# EAGLE schematic TeensyAmp_R5.0 (EAGLE 9.6.2)

## Sheet 1 of 3
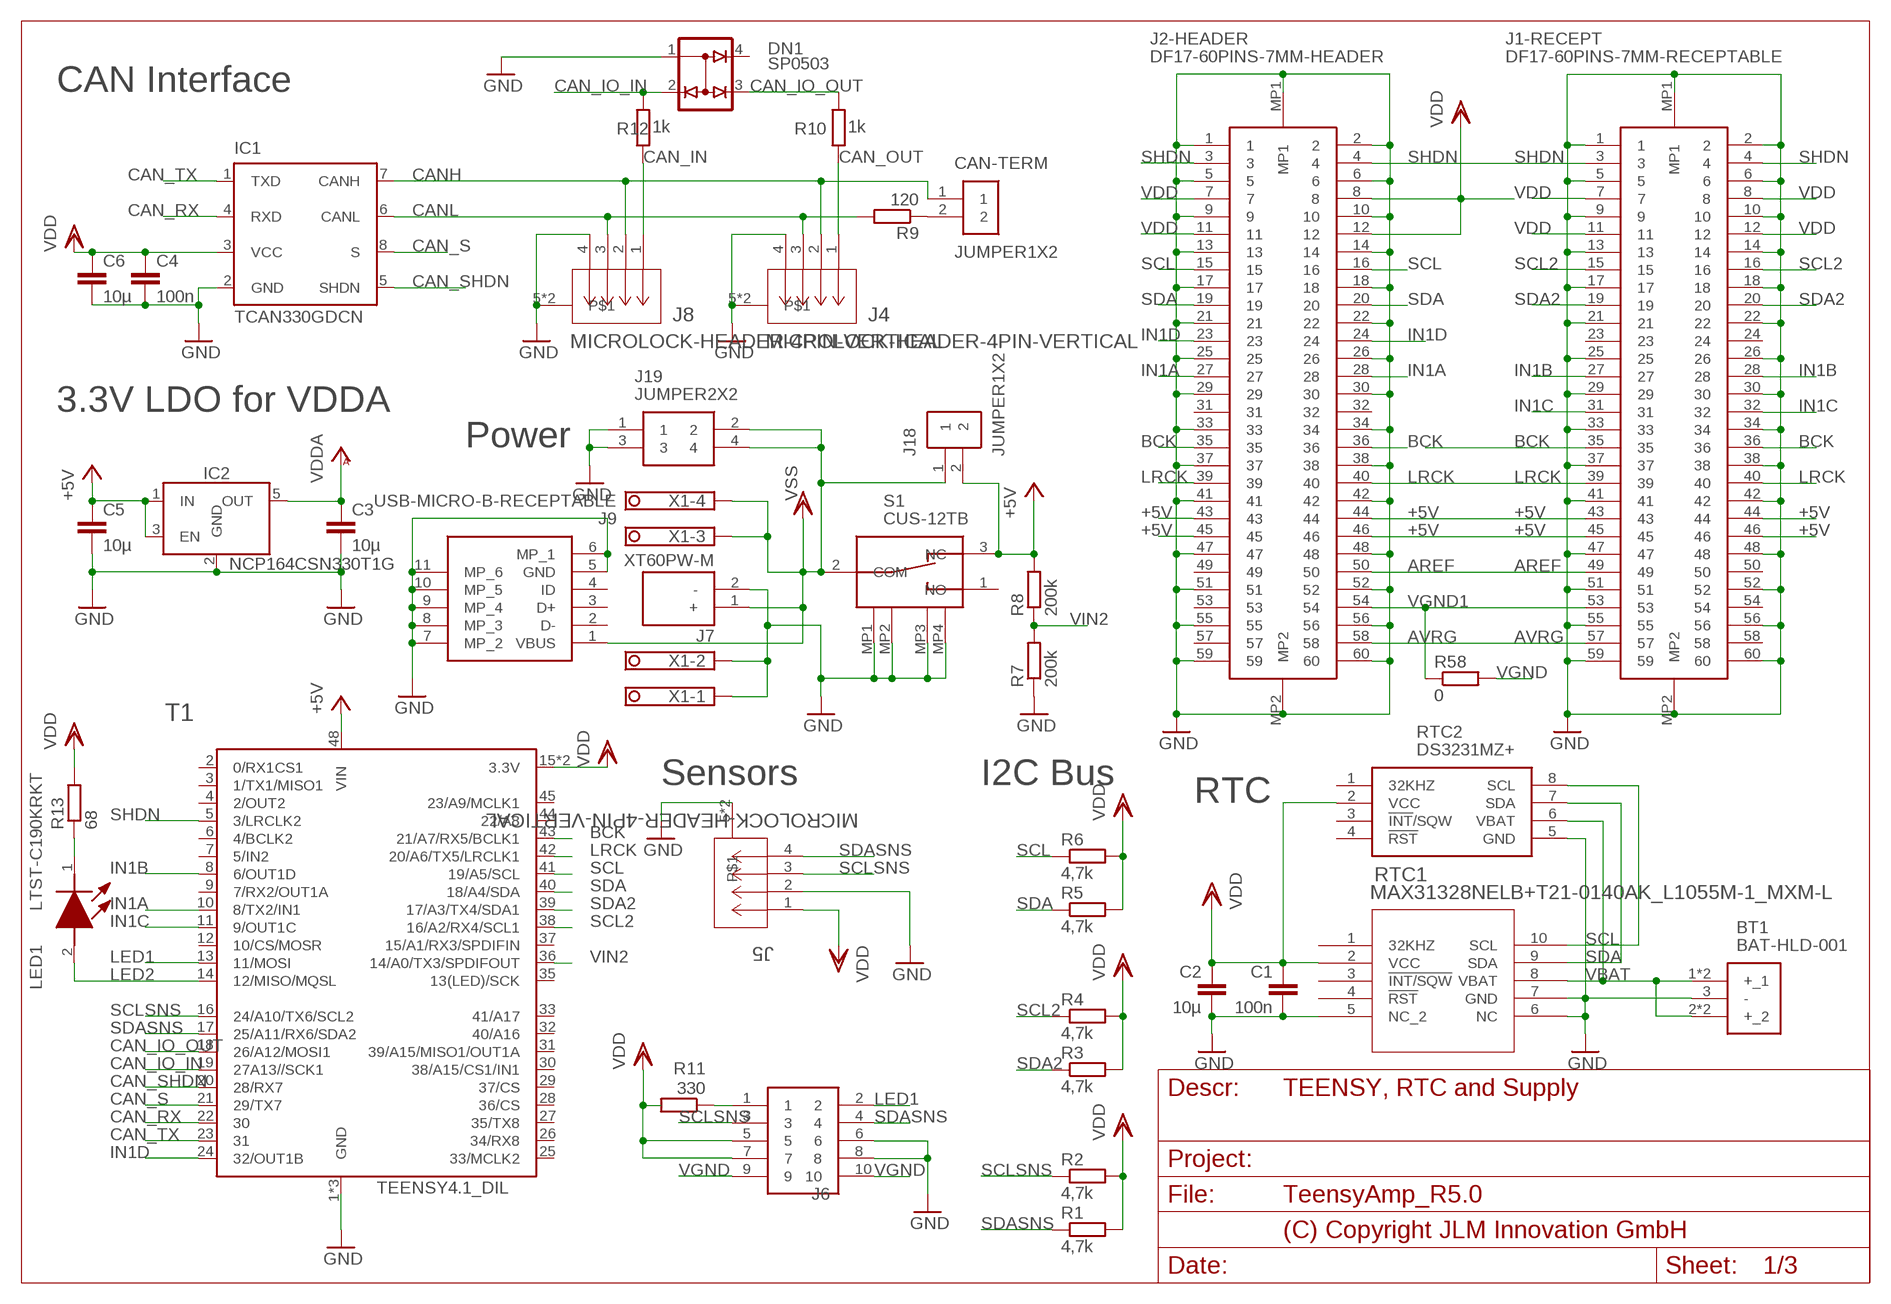
[diagram p0: schematic, sheet 1]
FRAME1 (DINA4_L): PAGE_DESCRIPTION: TEENSY, RTC and Supply

### Parts
BT1  BAT-HLD-001  [BATHLD001]
C1  100n  C-EUC0603  [C0603]
C2  10µ  C-EUC0603  [C0603]
C3  10µ  C-EUC0603  [C0603]
C4  100n  C-EUC0603  [C0603]
C5  10µ  C-EUC0603  [C0603]
C6  10µ  C-EUC0603  [C0603]
CAN-TERM  JUMPER1X2  [JMP1X2]
DN1  SP0503  [SOT143-R]
IC1  TCAN330GDCN  TCAN330DCN  [SOT65P280X145-8N]
IC2  NCP164CSN330T1G  LDO_ENSOT23-5  [SOT23-5]
J1-RECEPT  DF17-60PINS-7MM-RECEPTABLE  [DF173060DS05V57]
J2-HEADER  DF17-60PINS-7MM-HEADER  [DF174060DP05V57]
J4  MICROLOCK-HEADER-4PIN-VERTICAL  [CONN_50556804XX_MOL]
J5  MICROLOCK-HEADER-4PIN-VERTICAL  [CONN_50556804XX_MOL]
J6  JUMPER2x5  JUMPER2X5  [JUMPER2X5FP]
J7  XT60PW-M  [AMASS_XT60PW-M]
J8  MICROLOCK-HEADER-4PIN-VERTICAL  [CONN_50556804XX_MOL]
J9  USB-MICRO-B-RECEPTABLE  [473460001]
J18  JUMPER1X2  [JMP1X2]
J19  JUMPER2X2  [JMP2X2]
LED1  LTST-C190KRKT  LTST-C190KFKT  [LEDC1607X80N]
R1  4,7k  R_JLMR0603  [R0603]
R2  4,7k  R_JLMR0603  [R0603]
R3  4,7k  R_JLMR0603  [R0603]
R4  4,7k  R_JLMR0603  [R0603]
R5  4,7k  R_JLMR0603  [R0603]
R6  4,7k  R_JLMR0603  [R0603]
R7  200k  R_JLMR0603  [R0603]
R8  200k  R_JLMR0603  [R0603]
R9  120  R_JLMR0603  [R0603]
R10  1k  R_JLMR0603  [R0603]
R11  330  R_JLMR0603  [R0603]
R12  1k  R_JLMR0603  [R0603]
R13  68  R_JLMR0603  [R0603]
R58  0  R_JLMR0603  [R0603]
RTC1  MAX31328NELB+T21-0140AK_L1055M-1_MXM-L  [21-0140AK_L1055M-1_MXM-L]
RTC2  DS3231MZ+  [SOIC127P600X175-8N]
S1  CUS-12TB  [CUS12TB]
T1  TEENSY4.1_DIL  [TEENSY4.1_DIL]
X1  TERMINAL-BLOCK-4  [1751264]

### Nets
+5V: C5.1 IC2.1(IN) IC2.3(EN) J1-RECEPT.43 J1-RECEPT.44 J1-RECEPT.45 J1-RECEPT.46 J2-HEADER.43 J2-HEADER.44 J2-HEADER.45 J2-HEADER.46 J18.2 R8.2 S1.3(NC) T1.48(VIN)
AREF: J1-RECEPT.49 J2-HEADER.50 ; also sheet 2,3
AVRG: J1-RECEPT.57 J2-HEADER.58 ; also sheet 2,3
BCK: J1-RECEPT.35 J1-RECEPT.36 J2-HEADER.35 J2-HEADER.36 T1.43(21/A7/RX5/BCLK1) ; also sheet 2,3
CAN_IN: J8.1 R12.2
CAN_IO_IN: DN1.2(C2) R12.1 T1.19(27A13//SCK1)
CAN_IO_OUT: DN1.3(C3) R10.1 T1.18(26/A12/MOSI1)
CAN_OUT: J4.1 R10.2
CAN_RX: IC1.4(RXD) T1.22
CAN_S: IC1.8(S) T1.21(29/TX7)
CAN_SHDN: IC1.5(SHDN) T1.20(28/RX7)
CAN_TX: IC1.1(TXD) T1.23
CANH: CAN-TERM.1 IC1.7(CANH) J4.2 J8.2
CANL: IC1.6(CANL) J4.3 J8.3 R9.2
GND: BT1.3(-) C1.2 C2.2 C3.2 C4.2 C5.2 C6.2 DN1.1(A1) IC1.2(GND) IC2.2(GND) J1-RECEPT.1 J1-RECEPT.2 J1-RECEPT.5 J1-RECEPT.6 J1-RECEPT.9 J1-RECEPT.10 J1-RECEPT.13 J1-RECEPT.14 J1-RECEPT.17 J1-RECEPT.18 J1-RECEPT.21 J1-RECEPT.22 J1-RECEPT.25 J1-RECEPT.26 J1-RECEPT.29 J1-RECEPT.30 J1-RECEPT.33 J1-RECEPT.34 J1-RECEPT.37 J1-RECEPT.38 J1-RECEPT.41 J1-RECEPT.42 J1-RECEPT.47 J1-RECEPT.48 J1-RECEPT.51 J1-RECEPT.52 J1-RECEPT.55 J1-RECEPT.56 J1-RECEPT.59 J1-RECEPT.60 J1-RECEPT.MP1 J1-RECEPT.MP2 J2-HEADER.1 J2-HEADER.2 J2-HEADER.5 J2-HEADER.6 J2-HEADER.9 J2-HEADER.10 J2-HEADER.13 J2-HEADER.14 J2-HEADER.17 J2-HEADER.18 J2-HEADER.21 J2-HEADER.22 J2-HEADER.25 J2-HEADER.26 J2-HEADER.29 J2-HEADER.30 J2-HEADER.33 J2-HEADER.34 J2-HEADER.37 J2-HEADER.38 J2-HEADER.41 J2-HEADER.42 J2-HEADER.47 J2-HEADER.48 J2-HEADER.51 J2-HEADER.52 J2-HEADER.55 J2-HEADER.56 J2-HEADER.59 J2-HEADER.60 J2-HEADER.MP1 J2-HEADER.MP2 J4.4 J4.5 J4.6 J5.2 J5.5 J5.6 J6.6 J6.8 J7.2(-) J8.4 J8.5 J8.6 J9.5(GND) J9.6(MP_1) J9.7(MP_2) J9.8(MP_3) J9.9(MP_4) J9.10(MP_5) J9.11(MP_6) J19.1 J19.3 R7.1 RTC1.5(NC_2) RTC1.6(NC) RTC1.7(GND) RTC2.5(GND) S1.MP1 S1.MP2 S1.MP3 S1.MP4 T1.1(GND) T1.34(GND) T1.47(GND) X1.1 X1.2 ; also sheet 2,3
IN1A: J2-HEADER.27 J2-HEADER.28 T1.10(8/TX2/IN1) ; also sheet 2,3
IN1B: J1-RECEPT.27 J1-RECEPT.28 T1.8(6/OUT1D)
IN1C: J1-RECEPT.31 J1-RECEPT.32 T1.11(9/OUT1C)
IN1D: J2-HEADER.23 J2-HEADER.24 T1.24(32/OUT1B)
LED1: J6.2 T1.13(11/MOSI)
LED2: LED1.2(A) T1.14(12/MISO/MQSL)
LRCK: J1-RECEPT.39 J1-RECEPT.40 J2-HEADER.39 J2-HEADER.40 T1.42(20/A6/TX5/LRCLK1) ; also sheet 2,3
N$1: J6.1 R11.1
N$2: CAN-TERM.2 R9.1
N$4: LED1.1(K) R13.1
SCL: J2-HEADER.15 J2-HEADER.16 R6.1 RTC1.10(SCL) RTC2.8(SCL) T1.41(19/A5/SCL) ; also sheet 2,3
SCL2: J1-RECEPT.15 J1-RECEPT.16 R4.1 T1.38(16/A2/RX4/SCL1)
SCLSNS: J5.3 J6.3 R2.1 T1.16(24/A10/TX6/SCL2)
SDA: J2-HEADER.19 J2-HEADER.20 R5.1 RTC1.9(SDA) RTC2.7(SDA) T1.40(18/A4/SDA) ; also sheet 2,3
SDA2: J1-RECEPT.19 J1-RECEPT.20 R3.1 T1.39(17/A3/TX4/SDA1)
SDASNS: J5.4 J6.4 R1.1 T1.17(25/A11/RX6/SDA2)
SHDN: J1-RECEPT.3 J1-RECEPT.4 J2-HEADER.3 J2-HEADER.4 T1.5(3/LRCLK2) ; also sheet 2,3
VBAT: BT1.1(+_1) BT1.1B(+_1) BT1.2(+_2) BT1.2B(+_2) RTC1.8(VBAT) RTC2.6(VBAT)
VDD: C1.1 C2.1 C4.1 C6.1 IC1.3(VCC) J1-RECEPT.7 J1-RECEPT.8 J1-RECEPT.11 J1-RECEPT.12 J2-HEADER.7 J2-HEADER.8 J2-HEADER.11 J2-HEADER.12 J5.1 J6.5 J6.7 R1.2 R2.2 R3.2 R4.2 R5.2 R6.2 R11.2 R13.2 RTC1.2(VCC) RTC2.2(VCC) T1.15(3.3V) T1.46(3.3V) ; also sheet 2,3
VDDA: C3.1 IC2.5(OUT) ; also sheet 2,3
VGND: J6.9 J6.10 R58.2 ; also sheet 2,3
VGND1: J1-RECEPT.53 J2-HEADER.54 R58.1
VIN2: R7.2 R8.1 T1.36(14/A0/TX3/SPDIFOUT)
VSS: J7.1(+) J9.1(VBUS) J18.1 J19.2 J19.4 S1.2(COM) X1.3 X1.4
Unconnected: DN1.4(C4) J1-RECEPT.23 J1-RECEPT.24 J1-RECEPT.50 J1-RECEPT.54 J1-RECEPT.58 J2-HEADER.31 J2-HEADER.32 J2-HEADER.49 J2-HEADER.53 J2-HEADER.57 J9.2(D-) J9.3(D+) J9.4(ID) RTC1.1(32KHZ) RTC1.3(!INT/SQW) RTC1.4(!RST) RTC2.1(32KHZ) RTC2.3(!INT!/SQW) RTC2.4(!RST) S1.1(NO) T1.2(0/RX1CS1) T1.3(1/TX1/MISO1) T1.4(2/OUT2) T1.6(4/BCLK2) T1.7(5/IN2) T1.9(7/RX2/OUT1A) T1.12(10/CS/MOSR) T1.25(33/MCLK2) T1.26(34/RX8) T1.27(35/TX8) T1.28(36/CS) T1.29(37/CS) T1.30(38/A15/CS1/IN1) T1.31(39/A15/MISO1/OUT1A) T1.32(40/A16) T1.33(41/A17) T1.35(13(LED)/SCK) T1.37(15/A1/RX3/SPDIFIN) T1.44(22/A8) T1.45(23/A9/MCLK1)

### Notes on the sheet
- CAN Interface
- 3.3V LDO for VDDA
- Power
- Sensors | I2C Bus
- RTC

## Sheet 2 of 3
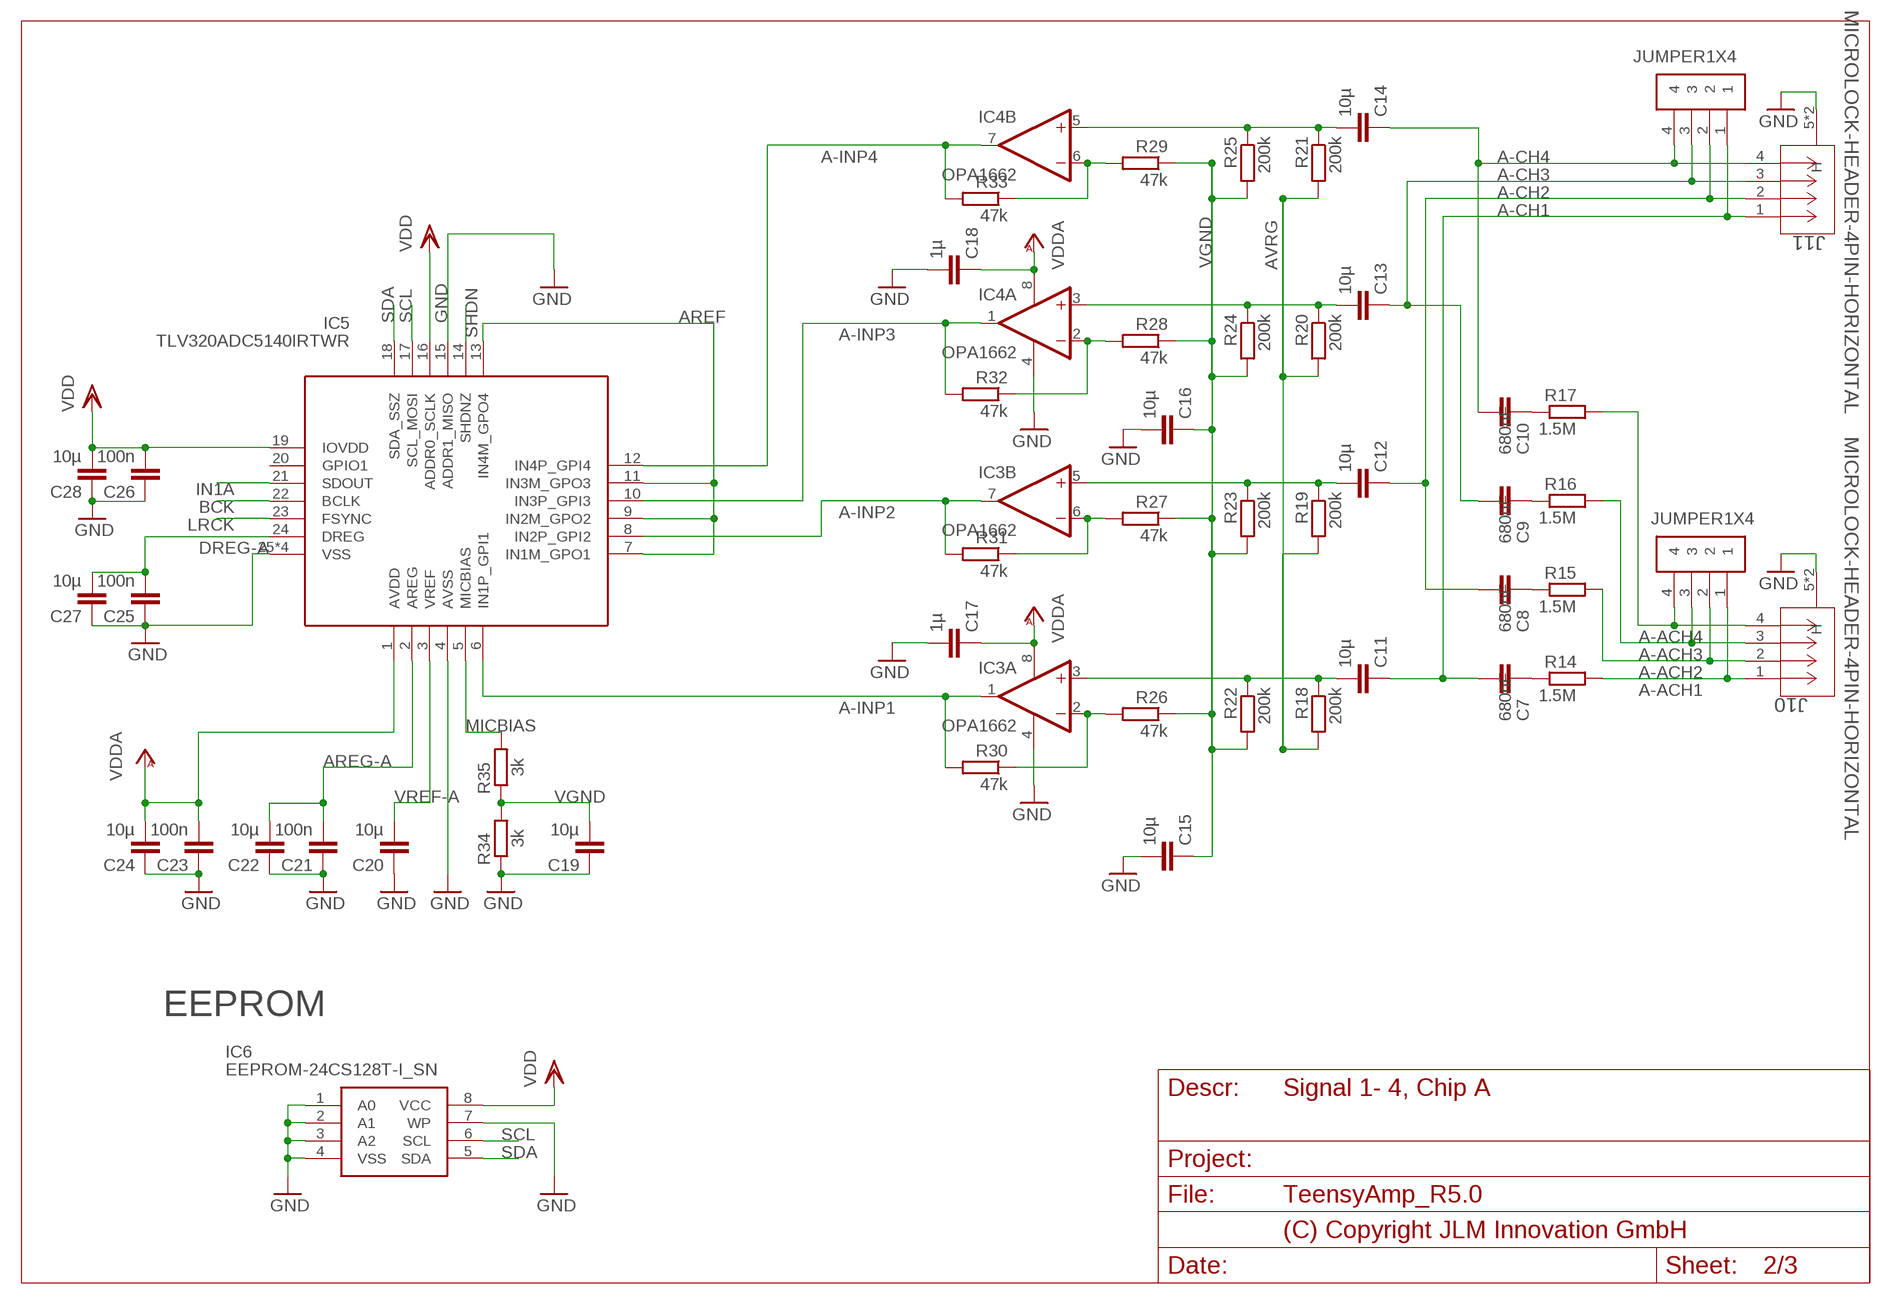
[diagram p1: schematic, sheet 2]
FRAME2 (DINA4_L): PAGE_DESCRIPTION: Signal 1- 4, Chip A

### Parts
C7  680nF  C-EUC0805  [C0805]
C8  680nF  C-EUC0805  [C0805]
C9  680nF  C-EUC0805  [C0805]
C10  680nF  C-EUC0805  [C0805]
C11  10µ  C-EUC0805  [C0805]
C12  10µ  C-EUC0805  [C0805]
C13  10µ  C-EUC0805  [C0805]
C14  10µ  C-EUC0805  [C0805]
C15  10µ  C-EUC0603  [C0603]
C16  10µ  C-EUC0603  [C0603]
C17  1µ  C-EUC0603  [C0603]
C18  1µ  C-EUC0603  [C0603]
C19  10µ  C-EUC0603  [C0603]
C20  10µ  C-EUC0603  [C0603]
C21  100n  C-EUC0603  [C0603]
C22  10µ  C-EUC0603  [C0603]
C23  100n  C-EUC0603  [C0603]
C24  10µ  C-EUC0603  [C0603]
C25  100n  C-EUC0603  [C0603]
C26  100n  C-EUC0603  [C0603]
C27  10µ  C-EUC0603  [C0603]
C28  10µ  C-EUC0603  [C0603]
IC3  OPA1662  OPA2344E  [MSOP08]
IC4  OPA1662  OPA2344E  [MSOP08]
IC5  TLV320ADC5140IRTWR  [QFN50P400X400X80-25N]
IC6  EEPROM-24CS128T-I_SN  [SOIC127P600X175-8N]
J10  MICROLOCK-HEADER-4PIN-HORIZONTAL  [CONN04_5055670471_MOL]
J11  MICROLOCK-HEADER-4PIN-HORIZONTAL  [CONN04_5055670471_MOL]
J12  JUMPER1X4  [JMP1X4]
J13  JUMPER1X4  [JMP1X4]
R14  1.5M  R_JLMR0603  [R0603]
R15  1.5M  R_JLMR0603  [R0603]
R16  1.5M  R_JLMR0603  [R0603]
R17  1.5M  R_JLMR0603  [R0603]
R18  200k  R_JLMR0603  [R0603]
R19  200k  R_JLMR0603  [R0603]
R20  200k  R_JLMR0603  [R0603]
R21  200k  R_JLMR0603  [R0603]
R22  200k  R_JLMR0603  [R0603]
R23  200k  R_JLMR0603  [R0603]
R24  200k  R_JLMR0603  [R0603]
R25  200k  R_JLMR0603  [R0603]
R26  47k  R_JLMR0603  [R0603]
R27  47k  R_JLMR0603  [R0603]
R28  47k  R_JLMR0603  [R0603]
R29  47k  R_JLMR0603  [R0603]
R30  47k  R_JLMR0603  [R0603]
R31  47k  R_JLMR0603  [R0603]
R32  47k  R_JLMR0603  [R0603]
R33  47k  R_JLMR0603  [R0603]
R34  3k  R_JLMR0603  [R0603]
R35  3k  R_JLMR0603  [R0603]

### Nets
A-ACH1: J10.1 J12.1 R14.1
A-ACH2: J10.2 J12.2 R15.1
A-ACH3: J10.3 J12.3 R16.1
A-ACH4: J10.4 J12.4 R17.1
A-CH1: C7.2 C11.1 J11.1 J13.1
A-CH2: C8.2 C12.1 J11.2 J13.2
A-CH3: C9.2 C13.1 J11.3 J13.3
A-CH4: C10.2 C14.1 J11.4 J13.4
A-INP1: IC3.1(A:OUT) IC5.6(IN1P_GPI1) R30.2
A-INP2: IC3.7(B:OUT) IC5.8(IN2P_GPI2) R31.2
A-INP3: IC4.1(A:OUT) IC5.10(IN3P_GPI3) R32.2
A-INP4: IC4.7(B:OUT) IC5.12(IN4P_GPI4) R33.2
AREF: IC5.7(IN1M_GPO1) IC5.9(IN2M_GPO2) IC5.11(IN3M_GPO3) IC5.13(IN4M_GPO4) ; also sheet 1,3
AREG-A: C21.2 C22.2 IC5.2(AREG)
AVRG: R18.2 R19.2 R20.2 R21.2 ; also sheet 1,3
BCK: IC5.22(BCLK) ; also sheet 1,3
DREG-A: C25.2 C27.2 IC5.24(DREG)
GND: C15.2 C16.2 C17.2 C18.2 C19.1 C20.1 C21.1 C22.1 C23.1 C24.1 C25.1 C26.1 C27.1 C28.1 IC3.4(A:V-) IC4.4(A:V-) IC5.4(AVSS) IC5.15(ADDR1_MISO) IC5.25(VSS) IC5.26(VSS) IC5.27(VSS) IC5.28(VSS) IC6.1(A0) IC6.2(A1) IC6.3(A2) IC6.4(VSS) IC6.7(WP) J10.5(H) J10.6(H) J11.5(H) J11.6(H) R34.1 ; also sheet 1,3
IN1A: IC5.21(SDOUT) ; also sheet 1,3
LRCK: IC5.23(FSYNC) ; also sheet 1,3
MICBIAS: IC5.5(MICBIAS) R35.2
N$6: C13.2 IC4.3(A:+IN) R20.1 R24.1
N$8: C14.2 IC4.5(B:+IN) R21.1 R25.1
N$9: C11.2 IC3.3(A:+IN) R18.1 R22.1
N$10: C12.2 IC3.5(B:+IN) R19.1 R23.1
N$13: IC3.6(B:-IN) R27.2 R31.1
N$15: C7.1 R14.2
N$16: C8.1 R15.2
N$18: C9.1 R16.2
N$27: C10.1 R17.2
N$31: IC4.2(A:-IN) R28.2 R32.1
N$32: IC4.6(B:-IN) R29.2 R33.1
N$33: IC3.2(A:-IN) R26.2 R30.1
SCL: IC5.17(SCL_MOSI) IC6.6(SCL) ; also sheet 1,3
SDA: IC5.18(SDA_SSZ) IC6.5(SDA) ; also sheet 1,3
SHDN: IC5.14(SHDNZ) ; also sheet 1,3
VDD: C26.2 C28.2 IC5.16(ADDR0_SCLK) IC5.19(IOVDD) IC6.8(VCC) ; also sheet 1,3
VDDA: C17.1 C18.1 C23.2 C24.2 IC3.8(A:V+) IC4.8(A:V+) IC5.1(AVDD) ; also sheet 1,3
VGND: C15.1 C16.1 C19.2 R22.2 R23.2 R24.2 R25.2 R26.1 R27.1 R28.1 R29.1 R34.2 R35.1 ; also sheet 1,3
VREF-A: C20.2 IC5.3(VREF)
Unconnected: IC5.20(GPIO1)

### Notes on the sheet
- EEPROM

## Sheet 3 of 3
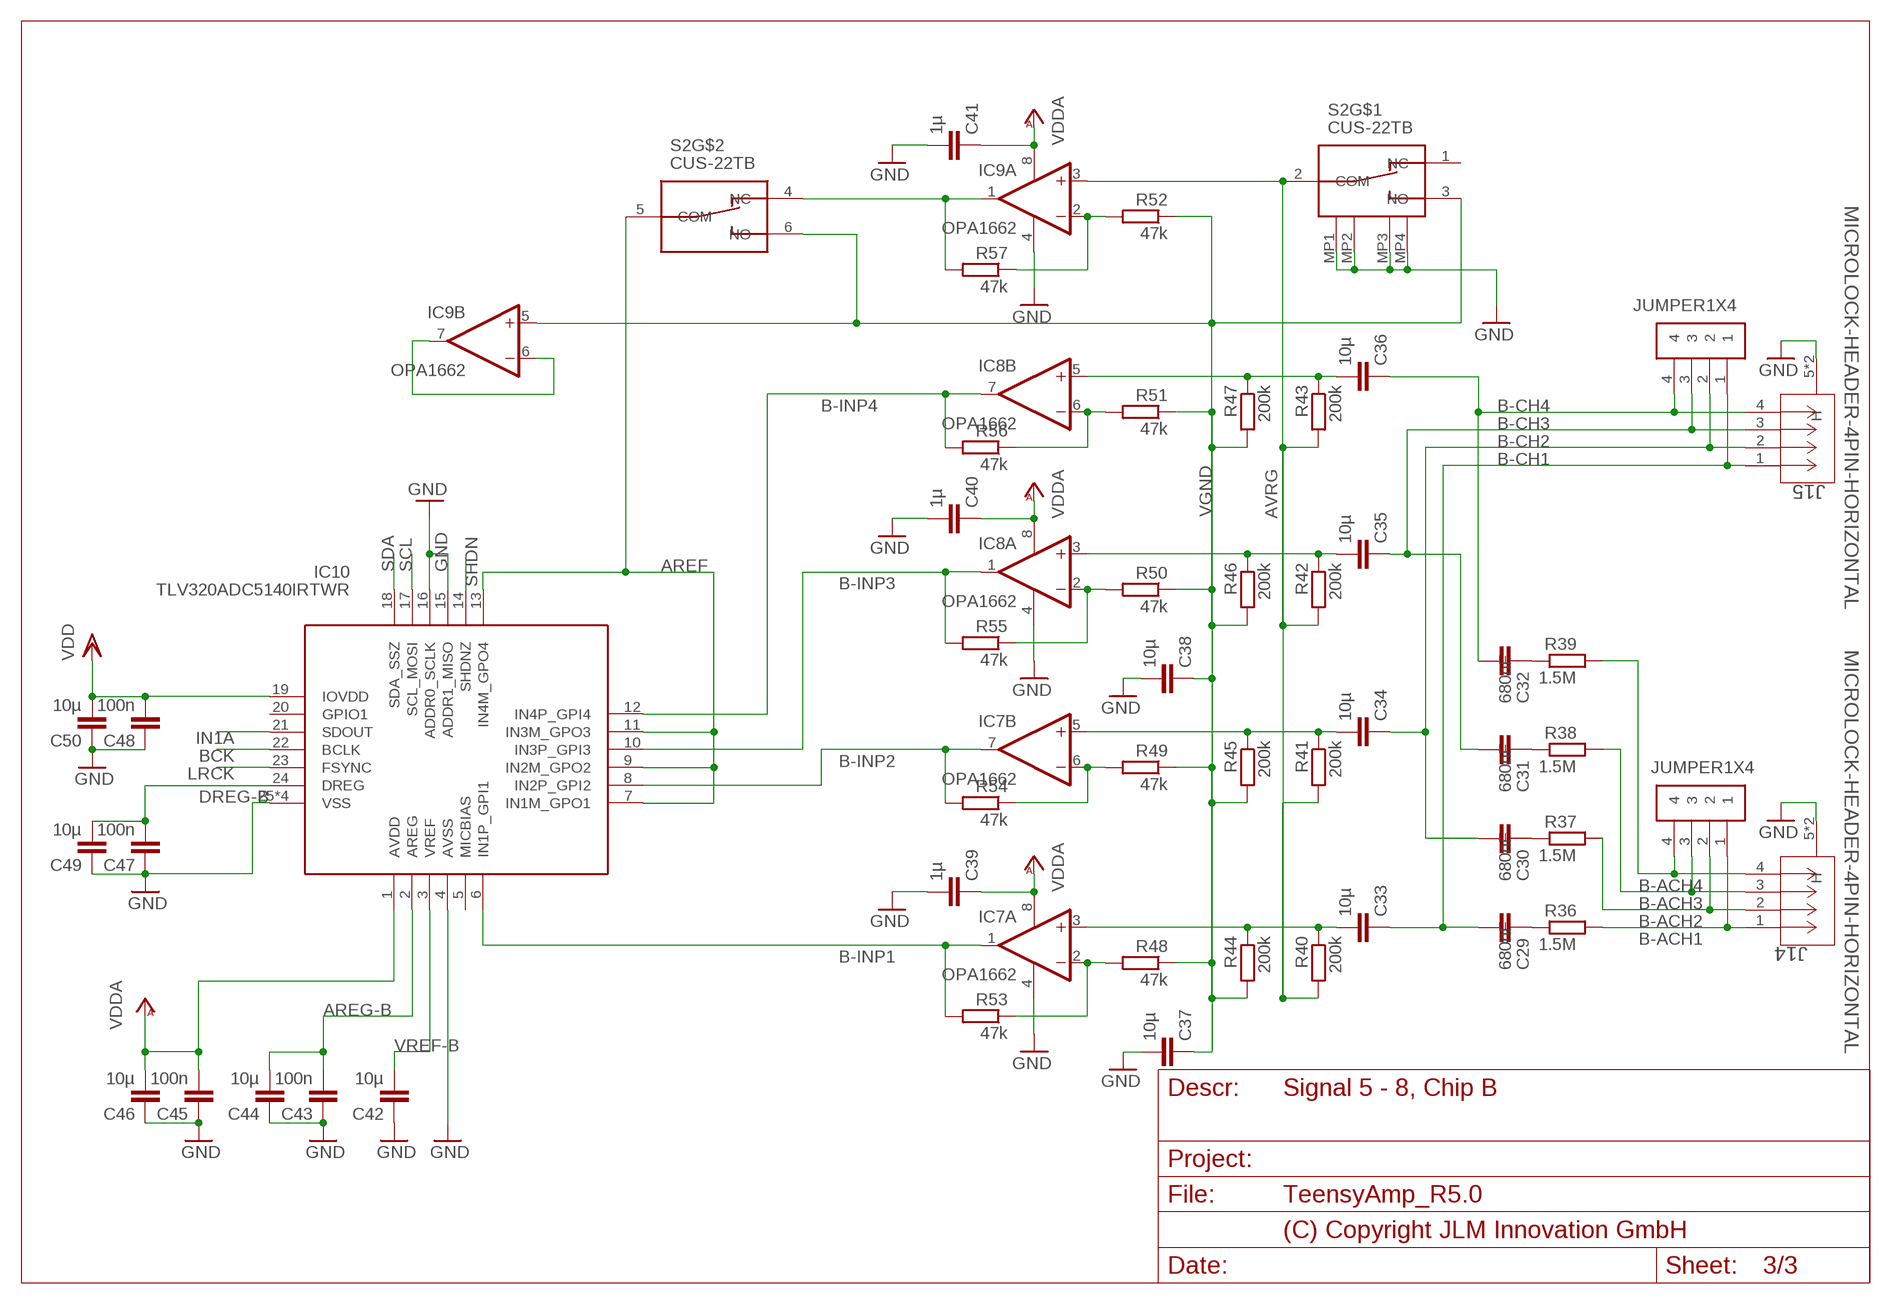
[diagram p2: schematic, sheet 3]
FRAME3 (DINA4_L): PAGE_DESCRIPTION: Signal 5 - 8, Chip B

### Parts
C29  680nF  C-EUC0805  [C0805]
C30  680nF  C-EUC0805  [C0805]
C31  680nF  C-EUC0805  [C0805]
C32  680nF  C-EUC0805  [C0805]
C33  10µ  C-EUC0805  [C0805]
C34  10µ  C-EUC0805  [C0805]
C35  10µ  C-EUC0805  [C0805]
C36  10µ  C-EUC0805  [C0805]
C37  10µ  C-EUC0603  [C0603]
C38  10µ  C-EUC0603  [C0603]
C39  1µ  C-EUC0603  [C0603]
C40  1µ  C-EUC0603  [C0603]
C41  1µ  C-EUC0603  [C0603]
C42  10µ  C-EUC0603  [C0603]
C43  100n  C-EUC0603  [C0603]
C44  10µ  C-EUC0603  [C0603]
C45  100n  C-EUC0603  [C0603]
C46  10µ  C-EUC0603  [C0603]
C47  100n  C-EUC0603  [C0603]
C48  100n  C-EUC0603  [C0603]
C49  10µ  C-EUC0603  [C0603]
C50  10µ  C-EUC0603  [C0603]
IC7  OPA1662  OPA2344E  [MSOP08]
IC8  OPA1662  OPA2344E  [MSOP08]
IC9  OPA1662  OPA2344E  [MSOP08]
IC10  TLV320ADC5140IRTWR  [QFN50P400X400X80-25N]
J14  MICROLOCK-HEADER-4PIN-HORIZONTAL  [CONN04_5055670471_MOL]
J15  MICROLOCK-HEADER-4PIN-HORIZONTAL  [CONN04_5055670471_MOL]
J16  JUMPER1X4  [JMP1X4]
J17  JUMPER1X4  [JMP1X4]
R36  1.5M  R_JLMR0603  [R0603]
R37  1.5M  R_JLMR0603  [R0603]
R38  1.5M  R_JLMR0603  [R0603]
R39  1.5M  R_JLMR0603  [R0603]
R40  200k  R_JLMR0603  [R0603]
R41  200k  R_JLMR0603  [R0603]
R42  200k  R_JLMR0603  [R0603]
R43  200k  R_JLMR0603  [R0603]
R44  200k  R_JLMR0603  [R0603]
R45  200k  R_JLMR0603  [R0603]
R46  200k  R_JLMR0603  [R0603]
R47  200k  R_JLMR0603  [R0603]
R48  47k  R_JLMR0603  [R0603]
R49  47k  R_JLMR0603  [R0603]
R50  47k  R_JLMR0603  [R0603]
R51  47k  R_JLMR0603  [R0603]
R52  47k  R_JLMR0603  [R0603]
R53  47k  R_JLMR0603  [R0603]
R54  47k  R_JLMR0603  [R0603]
R55  47k  R_JLMR0603  [R0603]
R56  47k  R_JLMR0603  [R0603]
R57  47k  R_JLMR0603  [R0603]
S2  CUS-22TB  [CUS22TB]

### Nets
AREF: IC10.7(IN1M_GPO1) IC10.9(IN2M_GPO2) IC10.11(IN3M_GPO3) IC10.13(IN4M_GPO4) S2.5(COM) ; also sheet 1,2
AREG-B: C43.2 C44.2 IC10.2(AREG)
AVRG: IC9.3(A:+IN) R40.2 R41.2 R42.2 R43.2 S2.2(COM) ; also sheet 1,2
B-ACH1: J14.1 J16.1 R36.1
B-ACH2: J14.2 J16.2 R37.1
B-ACH3: J14.3 J16.3 R38.1
B-ACH4: J14.4 J16.4 R39.1
B-CH1: C29.2 C33.1 J15.1 J17.1
B-CH2: C30.2 C34.1 J15.2 J17.2
B-CH3: C31.2 C35.1 J15.3 J17.3
B-CH4: C32.2 C36.1 J15.4 J17.4
B-INP1: IC7.1(A:OUT) IC10.6(IN1P_GPI1) R53.2
B-INP2: IC7.7(B:OUT) IC10.8(IN2P_GPI2) R54.2
B-INP3: IC8.1(A:OUT) IC10.10(IN3P_GPI3) R55.2
B-INP4: IC8.7(B:OUT) IC10.12(IN4P_GPI4) R56.2
BCK: IC10.22(BCLK) ; also sheet 1,2
DREG-B: C47.2 C49.2 IC10.24(DREG)
GND: C37.2 C38.2 C39.2 C40.2 C41.2 C42.1 C43.1 C44.1 C45.1 C46.1 C47.1 C48.1 C49.1 C50.1 IC7.4(A:V-) IC8.4(A:V-) IC9.4(A:V-) IC10.4(AVSS) IC10.15(ADDR1_MISO) IC10.16(ADDR0_SCLK) IC10.25(VSS) IC10.26(VSS) IC10.27(VSS) IC10.28(VSS) J14.5(H) J14.6(H) J15.5(H) J15.6(H) S2.MP1 S2.MP2 S2.MP3 S2.MP4 ; also sheet 1,2
IN1A: IC10.21(SDOUT) ; also sheet 1,2
LRCK: IC10.23(FSYNC) ; also sheet 1,2
N$3: IC9.2(A:-IN) R52.2 R57.1
N$5: IC8.2(A:-IN) R50.2 R55.1
N$11: IC8.6(B:-IN) R51.2 R56.1
N$12: IC7.2(A:-IN) R48.2 R53.1
N$14: IC7.6(B:-IN) R49.2 R54.1
N$17: C35.2 IC8.3(A:+IN) R42.1 R46.1
N$19: C36.2 IC8.5(B:+IN) R43.1 R47.1
N$20: C33.2 IC7.3(A:+IN) R40.1 R44.1
N$21: C34.2 IC7.5(B:+IN) R41.1 R45.1
N$22: C29.1 R36.2
N$23: C30.1 R37.2
N$24: IC9.1(A:OUT) R57.2 S2.4(NC)
N$25: C31.1 R38.2
N$26: C32.1 R39.2
N$28: IC9.6(B:-IN) IC9.7(B:OUT)
SCL: IC10.17(SCL_MOSI) ; also sheet 1,2
SDA: IC10.18(SDA_SSZ) ; also sheet 1,2
SHDN: IC10.14(SHDNZ) ; also sheet 1,2
VDD: C48.2 C50.2 IC10.19(IOVDD) ; also sheet 1,2
VDDA: C39.1 C40.1 C41.1 C45.2 C46.2 IC7.8(A:V+) IC8.8(A:V+) IC9.8(A:V+) IC10.1(AVDD) ; also sheet 1,2
VGND: C37.1 C38.1 IC9.5(B:+IN) R44.2 R45.2 R46.2 R47.2 R48.1 R49.1 R50.1 R51.1 R52.1 S2.3(NO) S2.6(NO) ; also sheet 1,2
VREF-B: C42.2 IC10.3(VREF)
Unconnected: IC10.5(MICBIAS) IC10.20(GPIO1) S2.1(NC)

## Library data of the parts
BT1 = teensyamp:BAT-HLD-001: Battery Holders, CR2032, 1 Position, Horizontal, Nickel, PCB Mount Alignment, Power, -40 257 F [-40 125 C] Source: Datasheet <https://www.te.com/commerce/DocumentDelivery/DDEController?Action=showdoc&DocId=Customer DrawingC-BAT-HLD-001-xxEpdfEnglishENG_CD_C-BAT-HLD-001-xx_E.pdfBAT-HLD-001>; DESCRIPTION: Battery Holders, CR2032, 1 Position, Horizontal, Nickel, PCB Mount Alignment, Power, -40 257 F [-40 125 C]; HEIGHT: 4.3mm; MANUFACTURER_NAME: TE Connectivity; MANUFACTURER_PART_NUMBER: BAT-HLD-001; MOUSER_PART_NUMBER: 712-BAT-HLD-001; MOUSER_PRICE-STOCK: https://www.mouser.co.uk/ProductDetail/TE-Connectivity-Linx-Technologies/BAT-HLD-001?qs=K5ta8V%252BWhta7hbVGfm4dqA%3D%3D
C1-C50 = teensyamp:C-EU: CAPACITOR, European symbol
CAN-TERM J18 = teensyamp:JUMPER1X2
DN1 = teensyamp:SP0503: SP0503BA 3 5VDC ESD supression diodes (e.g. USB protection); OC_DIGIKEY: F2715CT-ND; OC_FARNELL: 1827633
IC1 = teensyamp:TCAN330
IC2 = teensyamp:LDO_EN; OC_FARNELL: 3367831; OC_MOUSER: 863-NCP164CSN330T1G
IC3 IC4 IC7-IC9 = teensyamp:OPA2*: Dual Operational Amplifier Low Power, Single-Supply, Rail-To-Rail Operational Amplifier Source: http://focus.ti.com/lit/ds/symlink/opa2345.pdf http://focus.ti.com .. opa241.pdf http://focus.ti.com/lit/ds/symlink/opa2134.pdf
IC5 IC10 = teensyamp:TLV320ADC5140IRTWR: 4-Channel Quad ADC Delta-Sigma 768ksps Serial 24-Pin WQFN EP T/R Source: Datasheet <https://www.ti.com/lit/gpn/TLV320ADC5140>; DESCRIPTION: 4-Channel Quad ADC Delta-Sigma 768ksps Serial 24-Pin WQFN EP T/R; HEIGHT: 0.8mm; MANUFACTURER_NAME: Texas Instruments; MANUFACTURER_PART_NUMBER: TLV320ADC5140IRTWR; MOUSER_PART_NUMBER: 595-V320ADC5140IRTWR; MOUSER_PRICE-STOCK: https://www.mouser.co.uk/ProductDetail/Texas-Instruments/TLV320ADC5140IRTWR?qs=Cb2nCFKsA8oyrIT%252Bcv2aDg%3D%3D
IC6 = teensyamp:EEPROM-24CS128T-I_SN: EEPROM 128K 3.4MHz I2C SERIAL EEPROM, I-Temp, ECC, SOIC Source: Datasheet <https://4donline.ihs.com/images/VipMasterIC/IC/MCHP/MCHP-S-A0025344314/MCHP-S-A0025344314-1.pdf?hkey=61A2E4C270F0397D049F8F05BD4F1054>; DESCRIPTION: EEPROM 128K 3.4MHz I2C SERIAL EEPROM, I-Temp, ECC, SOIC; HEIGHT: 1.75mm; MANUFACTURER_NAME: Microchip; MANUFACTURER_PART_NUMBER: 24CS128T-I/SN
J1-RECEPT = teensyamp:DF17-60PINS-7MM-RECEPTABLE: Hirose DF17 Series 0.5mm 60 Way 2 Row Straight PCB Socket Surface Mount Board to Board Source: Datasheet <https://www.hirose.com/product/document?clcode=CL0683-0006-3-57&productname=DF17(3.0)-60DS-0.5V(57)&series=DF17&documenttype=2DDrawing&lang=en&documentid=0000993481>; DESCRIPTION: Hirose DF17 Series 0.5mm 60 Way 2 Row Straight PCB Socket Surface Mount Board to Board; HEIGHT: 3.65mm; MANUFACTURER_NAME: Hirose; MANUFACTURER_PART_NUMBER: DF17(3.0)-60DS-0.5V(57); MOUSER_PART_NUMBER: 798-DF173060DS05V57; MOUSER_PRICE-STOCK: https://www.mouser.co.uk/ProductDetail/Hirose-Connector/DF173.0-60DS-0.5V57?qs=eDUdFcBPps3N4nQ82enQ9g%3D%3D
J2-HEADER = teensyamp:DF17-60PINS-7MM-HEADER: Hirose DF17 Series, 0.5mm Pitch 60 Way 2 Row Straight PCB Header, Solder Termination, 0.3A Source: Datasheet <https://www.hirose.com/en/product/document?clcode=CL0683-0126-5-57&productname=DF17(4.0)-60DP-0.5V(57)&series=DF17&documenttype=2DDrawing&lang=en&documentid=0000994398>; DESCRIPTION: Hirose DF17 Series, 0.5mm Pitch 60 Way 2 Row Straight PCB Header, Solder Termination, 0.3A; HEIGHT: 6.45mm; MANUFACTURER_NAME: Hirose; MANUFACTURER_PART_NUMBER: DF17(4.0)-60DP-0.5V(57); MOUSER_PART_NUMBER: 798-DF174060DP05V57; MOUSER_PRICE-STOCK: https://www.mouser.co.uk/ProductDetail/Hirose-Connector/DF174.0-60DP-0.5V57?qs=eDUdFcBPps3I8b9%252Bfsb1tQ%3D%3D
J4 J5 J8 = teensyamp:MICROLOCK-HEADER-4PIN-VERTICAL: molex micro-lock plus vertical header 4 pins; COPYRIGHT: Copyright (C) 2025 Ultra Librarian. All rights reserved.; MANUFACTURER_PART_NUMBER: 5055680471; MFR_NAME: Molex Connector Corporation
J6 = teensyamp:JUMPER2X5: Jumper with 10 pins in 2 rows
J7 = teensyamp:XT60PW-M: XT60 male through hole; AVAILABILITY: Not in stock; CHECK_PRICES: https://www.snapeda.com/parts/XT60PW-M/AMASS/view-part/?ref=eda; DESCRIPTION: Socket, DC supply, male, PIN: 2; MF: AMASS; MP: XT60PW-M; PACKAGE: Package; PRICE: None; SNAPEDA_LINK: https://www.snapeda.com/parts/XT60PW-M/AMASS/view-part/?ref=snap
J9 = teensyamp:USB-MICRO-B-RECEPTABLE: Micro USB B Receptacle Bottom Mount Assy Molex Right Angle SMT Type B Version 2.0 Micro USB Connector Socket, 30 V ac, 1A 47352 MICRO-USB Source: Datasheet <http://www.molex.com/pdm_docs/sd/473460001_sd.pdf>; DESCRIPTION: Micro USB B Receptacle Bottom Mount Assy Molex Right Angle SMT Type B Version 2.0 Micro USB Connector Socket, 30 V ac, 1A 47352 MICRO-USB; HEIGHT: 3.19mm; MANUFACTURER_NAME: Molex; MANUFACTURER_PART_NUMBER: 47346-0001; MOUSER_PART_NUMBER: 538-47346-0001; MOUSER_PRICE-STOCK: https://www.mouser.co.uk/ProductDetail/Molex/47346-0001?qs=c2CV6XM0DweJBWaSeyWeCw%3D%3D
J10 J11 J14 J15 = teensyamp:MICROLOCK-HEADER-4PIN-HORIZONTAL: molex micro-lock plus horizontal header 4 pins; COPYRIGHT: Copyright (C) 2025 Ultra Librarian. All rights reserved.; MANUFACTURER_PART_NUMBER: 5055670471; MFR_NAME: Molex Connector Corporation
J12 J13 J16 J17 = teensyamp:JUMPER1X4
J19 = teensyamp:JUMPER2X2: 2x2 jumper
LED1 = teensyamp:LTST-C190KFKT: LED,SMD,0603,Orange,60mcd,130deg Lite-On LTST-C190KFKT Orange LED, 605 nm, 1608 (0603), Rectangle Lens SMD Package Source: Datasheet <https://datasheet.datasheetarchive.com/originals/distributors/Datasheets-305/79294.pdf>; DESCRIPTION: LED,SMD,0603,Orange,60mcd,130deg Lite-On LTST-C190KFKT Orange LED, 605 nm, 1608 (0603), Rectangle Lens SMD Package; HEIGHT: 0.8mm; MANUFACTURER_NAME: Lite-On; MANUFACTURER_PART_NUMBER: LTST-C190KFKT; MOUSER_PART_NUMBER: 859-LTST-C190KFKT; MOUSER_PRICE-STOCK: https://www.mouser.co.uk/ProductDetail/LITEON/LTST-C190KFKT?qs=6QHXI9jVcTyVErVIqD1vhg%3D%3D
R1-R58 = teensyamp:R_JLM: RESISTOR, European symbol
RTC1 = teensyamp:MAX31328NELB+T: MAX31328 real-time clock; COPYRIGHT: Copyright (C) 2025 Ultra Librarian. All rights reserved.; MANUFACTURER_PART_NUMBER: MAX31328NELB+T; MFR_NAME: Analog Devices Inc
RTC2 = teensyamp:DS3231MZ+: Real Time Clock 5+/-ppm RTC Source: Datasheet <http://datasheets.maximintegrated.com/en/ds/DS3231M.pdf>; DESCRIPTION: Real Time Clock 5+/-ppm RTC; HEIGHT: 1.75mm; MANUFACTURER_NAME: Analog Devices; MANUFACTURER_PART_NUMBER: DS3231MZ+; MOUSER_PART_NUMBER: 700-DS3231MZ+; MOUSER_PRICE-STOCK: https://www.mouser.co.uk/ProductDetail/Analog-Devices-Maxim-Integrated/DS3231MZ%2b?qs=4Rc5iGDDRGgASPOHxzykqQ%3D%3D
S1 = teensyamp:CUS-12TB: Slide Switches smd low profile slide switch, 1P2T, gull wing Source: Datasheet <https://www.nidec-copal-electronics.com/e/catalog/switch/cus.pdf>; DESCRIPTION: Slide Switches smd low profile slide switch, 1P2T, gull wing; HEIGHT: 1.4mm; MANUFACTURER_NAME: Nidec Copal; MANUFACTURER_PART_NUMBER: CUS-12TB
S2 = teensyamp:CUS-22TB: Slide Switches smd low profile slide switch, 2P2T, gull wing Source: Datasheet; DESCRIPTION: Slide Switches smd low profile slide switch, 2P2T, gull wing; HEIGHT: 2.9mm; MANUFACTURER_NAME: Nidec Copal; MANUFACTURER_PART_NUMBER: CUS-22TB; MOUSER_PART_NUMBER: 229-CUS-22TB; MOUSER_PRICE-STOCK: https://www.mouser.co.uk/ProductDetail/Nidec-Copal/CUS-22TB?qs=XeJtXLiO41RSSrLsJIcVSQ%3D%3D
T1 = teensyamp:TEENSY4.1_DIL
X1 = teensyamp:TERMINAL-BLOCK-4: MKDS 1/ 4-3,5 Printklemme Nennstrom: 10 A Bemessungsspannung: 160 V Raster: 3,5 mm Polzahl: 4 Montageart: Löten Anschlussart: Schraubanschluss Anschlussrichtung vom Leiter zur Platine: 0° Source: http://eshop.phoenixcontact.com .. 1751264.pdf; MPN: 1751264; OC_FARNELL: 2478588; OC_NEWARK: 10R0934

## Net classes
0 default: clearance 0.205 mm